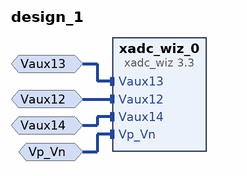
[diagram p0: block diagram of the top level]
# Vivado block design design_1, xc7a35ticsg324-1L, Vivado 2019.1
create_bd_design design_1

create_bd_intf_port -mode Slave -vlnv xilinx.com:interface:diff_analog_io_rtl:1.0 Vp_Vn
create_bd_intf_port -mode Slave -vlnv xilinx.com:interface:diff_analog_io_rtl:1.0 Vaux12
create_bd_intf_port -mode Slave -vlnv xilinx.com:interface:diff_analog_io_rtl:1.0 Vaux13
create_bd_intf_port -mode Slave -vlnv xilinx.com:interface:diff_analog_io_rtl:1.0 Vaux14

create_bd_cell -type ip -vlnv xilinx.com:ip:xadc_wiz:3.3 xadc_wiz_0
set_property -dict [list \
  CONFIG.AVERAGE_ENABLE_TEMPERATURE true \
  CONFIG.AVERAGE_ENABLE_VAUXP12_VAUXN12 true \
  CONFIG.AVERAGE_ENABLE_VAUXP13_VAUXN13 true \
  CONFIG.AVERAGE_ENABLE_VAUXP14_VAUXN14 true \
  CONFIG.AVERAGE_ENABLE_VP_VN true \
  CONFIG.CHANNEL_ENABLE_TEMPERATURE true \
  CONFIG.CHANNEL_ENABLE_VAUXP12_VAUXN12 true \
  CONFIG.CHANNEL_ENABLE_VAUXP13_VAUXN13 true \
  CONFIG.CHANNEL_ENABLE_VAUXP14_VAUXN14 true \
  CONFIG.CHANNEL_ENABLE_VP_VN true \
  CONFIG.ENABLE_DCLK false \
  CONFIG.ENABLE_DRP false \
  CONFIG.ENABLE_RESET true \
  CONFIG.EXTERNAL_MUX_CHANNEL VP_VN \
  CONFIG.INTERFACE_SELECTION None \
  CONFIG.SEQUENCER_MODE Continuous \
  CONFIG.SINGLE_CHANNEL_SELECTION TEMPERATURE \
  CONFIG.XADC_STARUP_SELECTION channel_sequencer \
] [get_bd_cells xadc_wiz_0]

# ---- connections ----

connect_bd_intf_net -intf_net Vaux13_1 [get_bd_intf_ports Vaux13] [get_bd_intf_pins xadc_wiz_0/Vaux13]
connect_bd_intf_net -intf_net Vaux12_1 [get_bd_intf_ports Vaux12] [get_bd_intf_pins xadc_wiz_0/Vaux12]
connect_bd_intf_net -intf_net Vaux14_1 [get_bd_intf_ports Vaux14] [get_bd_intf_pins xadc_wiz_0/Vaux14]
connect_bd_intf_net [get_bd_intf_ports Vp_Vn] [get_bd_intf_pins xadc_wiz_0/Vp_Vn]

validate_bd_design
save_bd_design
